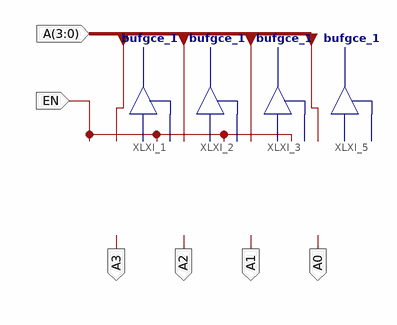
[diagram p0: schematic sheet 1]
// Xilinx ISE schematic Reg_Enable.sch (spartan3e) as structural Verilog: 4 symbols, 6 ports
module Reg_Enable (
  input  [3:0] A,
  input  EN,
  output A0,
  output A1,
  output A2,
  output A3
);

  bufgce_1 XLXI_5 (.CE(EN), .I(A[0]), .O(A0));
  bufgce_1 XLXI_3 (.CE(EN), .I(A[1]), .O(A1));
  bufgce_1 XLXI_2 (.CE(EN), .I(A[2]), .O(A2));
  bufgce_1 XLXI_1 (.CE(EN), .I(A[3]), .O(A3));
endmodule
